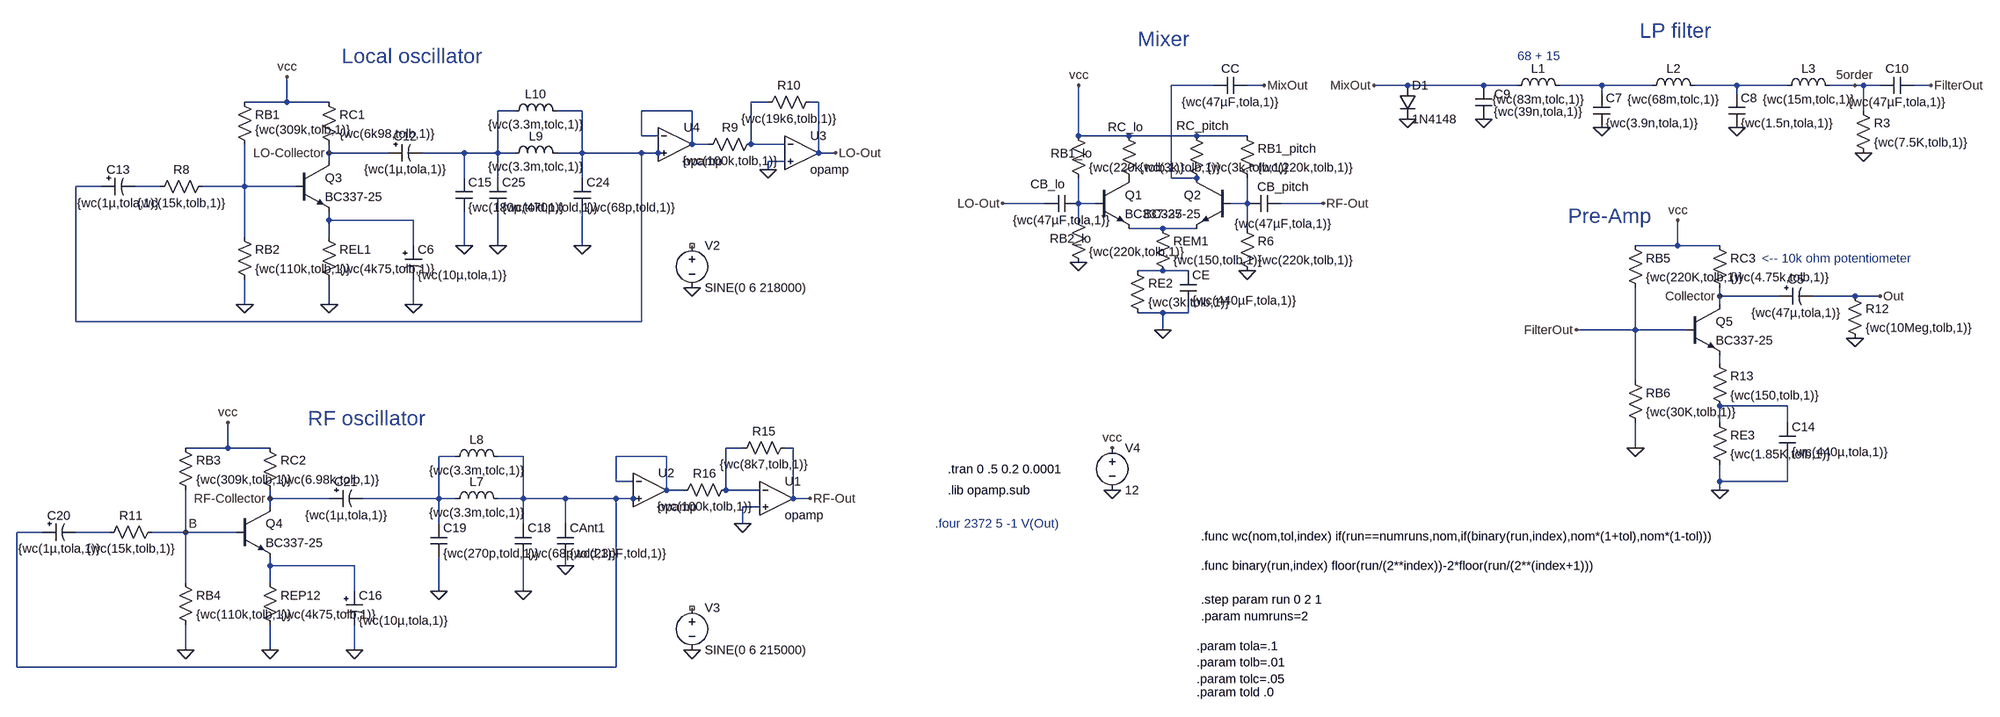
[diagram p0: schematic integrationHellWorstCaseBestCaseTolerances.asc]
integrationHellWorstCaseBestCaseTolerances.asc, the LTspice schematic file:
Version 4
SHEET 1 2740 1140
WIRE 224 -80 144 -80
WIRE 320 -80 288 -80
WIRE 592 -80 528 -80
WIRE 736 -80 592 -80
WIRE 800 -80 736 -80
WIRE 960 -80 880 -80
WIRE 1056 -80 960 -80
WIRE 1216 -80 1136 -80
WIRE 1312 -80 1216 -80
WIRE 1440 -80 1392 -80
WIRE 1456 -80 1440 -80
WIRE 1488 -80 1456 -80
WIRE 1584 -80 1552 -80
WIRE 960 -64 960 -80
WIRE 1216 -64 1216 -80
WIRE -1536 -48 -1536 -96
WIRE -1536 -48 -1616 -48
WIRE -1456 -48 -1536 -48
WIRE -624 -48 -656 -48
WIRE -528 -48 -544 -48
WIRE -1104 -32 -1136 -32
WIRE -976 -32 -1024 -32
WIRE -768 -32 -864 -32
WIRE 1456 -32 1456 -80
WIRE -864 16 -864 -32
WIRE -832 16 -864 16
WIRE -32 16 -32 -80
WIRE 64 16 -32 16
WIRE 192 16 64 16
WIRE 288 16 192 16
WIRE -768 32 -768 -32
WIRE -736 32 -768 32
WIRE -656 32 -656 -48
WIRE -592 32 -656 32
WIRE -1456 48 -1456 32
WIRE -1344 48 -1456 48
WIRE -1200 48 -1280 48
WIRE -1136 48 -1136 -32
WIRE -1136 48 -1200 48
WIRE -1104 48 -1136 48
WIRE -976 48 -976 -32
WIRE -976 48 -1024 48
WIRE -864 48 -976 48
WIRE -832 48 -832 32
WIRE -832 48 -864 48
WIRE -528 48 -528 -48
WIRE -496 48 -528 48
WIRE -1456 64 -1456 48
WIRE -592 64 -624 64
WIRE -624 80 -624 64
WIRE -1200 96 -1200 48
WIRE -1136 96 -1136 48
WIRE -976 96 -976 48
WIRE 144 96 144 -80
WIRE 192 96 144 96
WIRE -1888 112 -1936 112
WIRE -1776 112 -1824 112
WIRE -1616 112 -1616 32
WIRE -1616 112 -1696 112
WIRE -1520 112 -1616 112
WIRE -96 144 -176 144
WIRE -32 144 -32 96
WIRE 0 144 -32 144
WIRE 288 144 288 96
WIRE 288 144 256 144
WIRE 432 144 352 144
WIRE -1456 176 -1456 160
WIRE -1296 176 -1456 176
WIRE -32 176 -32 144
WIRE 128 192 64 192
WIRE 192 192 128 192
WIRE 288 192 288 144
WIRE -1616 208 -1616 112
WIRE -1456 208 -1456 176
WIRE -1296 224 -1296 176
WIRE -1200 224 -1200 160
WIRE -1136 224 -1136 160
WIRE -976 224 -976 160
WIRE 1104 224 1104 176
WIRE 1104 224 1024 224
WIRE 1184 224 1104 224
WIRE 128 272 80 272
WIRE 176 272 128 272
WIRE 1184 320 1184 304
WIRE 1296 320 1184 320
WIRE 1440 320 1360 320
WIRE 1488 320 1440 320
WIRE -1616 336 -1616 288
WIRE -1456 336 -1456 288
WIRE -1296 336 -1296 288
WIRE 1184 336 1184 320
WIRE 128 352 80 352
WIRE 176 352 176 336
WIRE 176 352 128 352
WIRE -1936 368 -1936 112
WIRE -864 368 -864 48
WIRE -864 368 -1936 368
WIRE 128 384 128 352
WIRE 1024 384 1024 304
WIRE 1024 384 912 384
WIRE 1120 384 1024 384
WIRE 1184 448 1184 432
WIRE 1024 480 1024 384
WIRE 1312 528 1184 528
WIRE 1184 560 1184 528
WIRE 1312 560 1312 528
WIRE -1648 608 -1648 560
WIRE -1648 608 -1728 608
WIRE -1568 608 -1648 608
WIRE -672 608 -704 608
WIRE -576 608 -592 608
WIRE 1024 608 1024 560
WIRE -1216 624 -1248 624
WIRE -1088 624 -1136 624
WIRE -816 624 -912 624
WIRE -912 672 -912 624
WIRE -880 672 -912 672
WIRE 1184 672 1184 640
WIRE 1312 672 1312 624
WIRE 1312 672 1184 672
WIRE -816 688 -816 624
WIRE -784 688 -816 688
WIRE -704 688 -704 608
WIRE -640 688 -704 688
WIRE 1184 688 1184 672
WIRE -1568 704 -1568 688
WIRE -1456 704 -1568 704
WIRE -1248 704 -1248 624
WIRE -1248 704 -1392 704
WIRE -1216 704 -1248 704
WIRE -1088 704 -1088 624
WIRE -1088 704 -1136 704
WIRE -1008 704 -1088 704
WIRE -912 704 -1008 704
WIRE -880 704 -880 688
WIRE -880 704 -912 704
WIRE -576 704 -576 608
WIRE -544 704 -576 704
WIRE -1568 720 -1568 704
WIRE -640 720 -672 720
WIRE -1248 752 -1248 704
WIRE -1088 752 -1088 704
WIRE -1008 752 -1008 704
WIRE -672 752 -672 720
WIRE -2000 768 -2048 768
WIRE -1872 768 -1936 768
WIRE -1728 768 -1728 688
WIRE -1728 768 -1792 768
WIRE -1632 768 -1728 768
WIRE -1568 832 -1568 816
WIRE -1408 832 -1568 832
WIRE -1008 832 -1008 816
WIRE -1728 864 -1728 768
WIRE -1568 864 -1568 832
WIRE -1408 880 -1408 832
WIRE -1248 880 -1248 816
WIRE -1088 880 -1088 816
WIRE -1728 992 -1728 944
WIRE -1568 992 -1568 944
WIRE -1408 992 -1408 944
WIRE -2048 1024 -2048 768
WIRE -912 1024 -912 704
WIRE -912 1024 -2048 1024
FLAG 128 384 0
FLAG -32 256 0
FLAG 288 272 0
FLAG -768 304 0
FLAG -768 992 0
FLAG 320 -80 MixOut
FLAG 1584 -80 FilterOut
FLAG 528 -80 MixOut
FLAG 1216 0 0
FLAG 960 0 0
FLAG 1456 48 0
FLAG 1440 -80 5order
FLAG 592 -16 0
FLAG 736 -16 0
FLAG -1536 -96 vcc
FLAG 32 608 vcc
FLAG 32 688 0
FLAG -1296 336 0
FLAG -1456 336 0
FLAG -1616 336 0
FLAG -1456 48 LO-Collector
FLAG -496 48 LO-Out
FLAG -32 -80 vcc
FLAG -176 144 LO-Out
FLAG -1648 560 vcc
FLAG -1408 992 0
FLAG -1568 992 0
FLAG -1728 992 0
FLAG -1568 704 RF-Collector
FLAG -1728 768 B
FLAG -1088 880 0
FLAG -1248 880 0
FLAG -976 224 0
FLAG -1136 224 0
FLAG 432 144 RF-Out
FLAG -544 704 RF-Out
FLAG -1008 832 0
FLAG -672 752 0
FLAG -624 80 0
FLAG 1104 176 vcc
FLAG 1184 688 0
FLAG 1024 608 0
FLAG 1184 320 Collector
FLAG 1488 320 Out
FLAG 1440 400 0
FLAG 912 384 FilterOut
FLAG -1200 224 0
DATAFLAG -1456 48 ""
SYMBOL npn 0 96 R0
SYMATTR InstName Q1
SYMATTR Value BC337-25
SYMBOL npn 256 96 M0
SYMATTR InstName Q2
SYMATTR Value BC337-25
SYMBOL res 112 176 R0
SYMATTR InstName REM1
SYMATTR Value {wc(150,tolb,1)}
SYMBOL res 64 256 R0
SYMATTR InstName RE2
SYMATTR Value {wc(3k,tolb,1)}
SYMBOL cap 160 272 R0
SYMATTR InstName CE
SYMATTR Value {wc(440µF,tola,1)}
SYMBOL res -48 0 R0
WINDOW 0 -37 49 Left 2
SYMATTR InstName RB1_lo
SYMATTR Value {wc(220k,tolb,1)}
SYMBOL res -48 160 R0
WINDOW 0 -38 51 Left 2
SYMATTR InstName RB2_lo
SYMATTR Value {wc(220k,tolb,1)}
SYMBOL res 272 176 R0
SYMATTR InstName R6
SYMATTR Value {wc(220k,tolb,1)}
SYMBOL res 272 0 R0
SYMATTR InstName RB1_pitch
SYMATTR Value {wc(220k,tolb,1)}
SYMBOL cap -32 128 R90
WINDOW 0 -5 58 VBottom 2
WINDOW 3 32 32 VTop 2
SYMATTR InstName CB_lo
SYMATTR Value {wc(47µF,tola,1)}
SYMBOL cap 352 128 R90
WINDOW 0 0 -4 VBottom 2
WINDOW 3 39 -4 VTop 2
SYMATTR InstName CB_pitch
SYMATTR Value {wc(47µF,tola,1)}
SYMBOL voltage -768 208 R0
WINDOW 123 0 0 Left 0
WINDOW 39 0 0 Left 0
SYMATTR InstName V2
SYMATTR Value SINE(0 6 218000)
SYMBOL voltage -768 896 R0
WINDOW 123 0 0 Left 0
WINDOW 39 0 0 Left 0
SYMATTR InstName V3
SYMATTR Value SINE(0 6 215000)
SYMBOL cap 288 -96 R90
WINDOW 0 0 32 VBottom 2
WINDOW 3 32 32 VTop 2
SYMATTR InstName CC
SYMATTR Value {wc(47µF,tola,1)}
SYMBOL res 176 0 R0
WINDOW 0 -22 -3 Left 2
SYMATTR InstName RC_pitch
SYMATTR Value {wc(3k,tolb,1)}
SYMBOL ind 784 -64 R270
WINDOW 0 32 56 VTop 2
WINDOW 3 5 56 VBottom 2
SYMATTR InstName L1
SYMATTR Value {wc(83m,tolc,1)}
SYMBOL ind 1040 -64 R270
WINDOW 0 32 56 VTop 2
WINDOW 3 5 56 VBottom 2
SYMATTR InstName L2
SYMATTR Value {wc(68m,tolc,1)}
SYMBOL cap 944 -64 R0
SYMATTR InstName C7
SYMATTR Value {wc(3.9n,tola,1)}
SYMBOL cap 1200 -64 R0
SYMATTR InstName C8
SYMATTR Value {wc(1.5n,tola,1)}
SYMBOL ind 1296 -64 R270
WINDOW 0 32 56 VTop 2
WINDOW 3 5 56 VBottom 2
SYMATTR InstName L3
SYMATTR Value {wc(15m,tolc,1)}
SYMBOL res 1440 -48 R0
SYMATTR InstName R3
SYMATTR Value {wc(7.5K,tolb,1)}
SYMBOL diode 576 -80 R0
SYMATTR InstName D1
SYMATTR Value 1N4148
SYMBOL cap 720 -80 R0
WINDOW 0 36 17 Left 2
WINDOW 3 35 50 Left 2
SYMATTR InstName C9
SYMATTR Value {wc(39n,tola,1)}
SYMBOL cap 1552 -96 R90
WINDOW 0 0 32 VBottom 2
WINDOW 3 32 32 VTop 2
SYMATTR InstName C10
SYMATTR Value {wc(47µF,tola,1)}
SYMBOL res -1632 -64 R0
WINDOW 3 36 68 Left 2
SYMATTR Value {wc(309k,tolb,1)}
SYMATTR InstName RB1
SYMBOL res -1472 -64 R0
SYMATTR InstName RC1
SYMATTR Value {wc(6k98,tolb,1)}
SYMBOL res -1472 192 R0
SYMATTR InstName REL1
SYMATTR Value {wc(4k75,tolb,1)}
SYMBOL res -1632 192 R0
SYMATTR InstName RB2
SYMATTR Value {wc(110k,tolb,1)}
SYMBOL polcap -1312 224 R0
SYMATTR InstName C6
SYMATTR Value {wc(10µ,tola,1)}
SYMBOL voltage 32 592 R0
WINDOW 123 0 0 Left 0
WINDOW 39 0 0 Left 0
SYMATTR InstName V4
SYMATTR Value 12
SYMBOL npn -1520 64 R0
SYMATTR InstName Q3
SYMATTR Value BC337-25
SYMBOL res -1680 96 R90
WINDOW 0 0 56 VBottom 2
WINDOW 3 32 56 VTop 2
SYMATTR InstName R8
SYMATTR Value {wc(15k,tolb,1)}
SYMBOL polcap -1344 32 M90
WINDOW 0 0 32 VBottom 2
WINDOW 3 32 32 VTop 2
SYMATTR InstName C12
SYMATTR Value {wc(1µ,tola,1)}
SYMBOL polcap -1888 96 M90
WINDOW 0 0 32 VBottom 2
WINDOW 3 32 32 VTop 2
SYMATTR InstName C13
SYMATTR Value {wc(1µ,tola,1)}
SYMBOL res -1744 592 R0
SYMATTR InstName RB3
SYMATTR Value {wc(309k,tolb,1)}
SYMBOL res -1584 592 R0
SYMATTR InstName RC2
SYMATTR Value {wc(6.98k,tolb,1)}
SYMBOL res -1584 848 R0
SYMATTR InstName REP12
SYMATTR Value {wc(4k75,tolb,1)}
SYMBOL res -1744 848 R0
SYMATTR InstName RB4
SYMATTR Value {wc(110k,tolb,1)}
SYMBOL polcap -1424 880 R0
SYMATTR InstName C16
SYMATTR Value {wc(10µ,tola,1)}
SYMBOL npn -1632 720 R0
SYMATTR InstName Q4
SYMATTR Value BC337-25
SYMBOL res -1776 752 R90
WINDOW 0 0 56 VBottom 2
WINDOW 3 32 56 VTop 2
SYMATTR InstName R11
SYMATTR Value {wc(15k,tolb,1)}
SYMBOL ind -1120 720 M270
WINDOW 0 32 56 VTop 2
WINDOW 3 5 56 VBottom 2
SYMATTR InstName L7
SYMATTR Value {wc(3.3m,tolc,1)}
SYMBOL cap -1104 752 R0
SYMATTR InstName C18
SYMATTR Value {wc(68p,told,1)}
SYMBOL cap -1264 752 R0
SYMATTR InstName C19
SYMATTR Value {wc(270p,told,1)}
SYMBOL cap -1024 752 R0
SYMATTR InstName CAnt1
SYMATTR Value {wc(23pF,told,1)}
SYMBOL polcap -2000 752 M90
WINDOW 0 0 32 VBottom 2
WINDOW 3 32 32 VTop 2
SYMATTR InstName C20
SYMATTR Value {wc(1µ,tola,1)}
SYMBOL polcap -1456 688 M90
WINDOW 0 0 32 VBottom 2
WINDOW 3 32 32 VTop 2
SYMATTR InstName C21
SYMATTR Value {wc(1µ,tola,1)}
SYMBOL ind -1232 640 R270
WINDOW 0 32 56 VTop 2
WINDOW 3 5 56 VBottom 2
SYMATTR InstName L8
SYMATTR Value {wc(3.3m,tolc,1)}
SYMBOL ind -1008 64 M270
WINDOW 0 32 56 VTop 2
WINDOW 3 5 56 VBottom 2
SYMATTR InstName L9
SYMATTR Value {wc(3.3m,tolc,1)}
SYMBOL cap -992 96 R0
SYMATTR InstName C24
SYMATTR Value {wc(68p,told,1)}
SYMBOL cap -1152 96 R0
SYMATTR InstName C25
SYMATTR Value {wc(470p,told,1)}
SYMBOL ind -1120 -16 R270
WINDOW 0 32 56 VTop 2
WINDOW 3 5 56 VBottom 2
SYMATTR InstName L10
SYMATTR Value {wc(3.3m,tolc,1)}
SYMBOL res 48 0 R0
WINDOW 0 -24 -1 Left 2
SYMATTR InstName RC_lo
SYMATTR Value {wc(3k,tolb,1)}
SYMBOL OpAmps\\opamp -560 -16 R0
SYMATTR InstName U3
SYMBOL OpAmps\\opamp -800 -32 R0
SYMATTR InstName U4
SYMBOL res -528 -64 R90
WINDOW 0 0 56 VBottom 2
WINDOW 3 32 56 VTop 2
SYMATTR InstName R10
SYMATTR Value {wc(19k6,tolb,1)}
SYMBOL res -640 16 R90
WINDOW 0 0 56 VBottom 2
WINDOW 3 32 56 VTop 2
SYMATTR InstName R9
SYMATTR Value {wc(100k,tolb,1)}
SYMBOL OpAmps\\opamp -608 640 R0
SYMATTR InstName U1
SYMBOL OpAmps\\opamp -848 624 R0
SYMATTR InstName U2
SYMBOL res -576 592 R90
WINDOW 0 0 56 VBottom 2
WINDOW 3 32 56 VTop 2
SYMATTR InstName R15
SYMATTR Value {wc(8k7,tolb,1)}
SYMBOL res -688 672 R90
WINDOW 0 0 56 VBottom 2
WINDOW 3 32 56 VTop 2
SYMATTR InstName R16
SYMATTR Value {wc(100k,tolb,1)}
SYMBOL res 1008 208 R0
SYMATTR InstName RB5
SYMATTR Value {wc(220K,tolb,1)}
SYMBOL res 1168 208 R0
SYMATTR InstName RC3
SYMATTR Value {wc(4.75k,tolb,1)}
SYMBOL res 1168 544 R0
SYMATTR InstName RE3
SYMATTR Value {wc(1.85K,tolb,1)}
SYMBOL res 1008 464 R0
SYMATTR InstName RB6
SYMATTR Value {wc(30K,tolb,1)}
SYMBOL polcap 1296 304 M90
WINDOW 0 0 32 VBottom 2
WINDOW 3 32 32 VTop 2
SYMATTR InstName C5
SYMATTR Value {wc(47µ,tola,1)}
SYMBOL res 1424 304 R0
SYMATTR InstName R12
SYMATTR Value {wc(10Meg,tolb,1)}
SYMBOL npn 1120 336 R0
SYMATTR InstName Q5
SYMATTR Value BC337-25
SYMBOL cap 1296 560 R0
SYMATTR InstName C14
SYMATTR Value {wc(440µ,tola,1)}
SYMBOL res 1168 432 R0
SYMATTR InstName R13
SYMATTR Value {wc(150,tolb,1)}
SYMBOL cap -1216 96 R0
SYMATTR InstName C15
SYMATTR Value {wc(180p,told,1)}
TEXT -280 648 Left 2 !.tran 0 .5 0.2 0.0001
TEXT -280 688 Left 2 !.lib opamp.sub
TEXT -1432 -136 Left 4 ;Local oscillator
TEXT -1496 552 Left 4 ;RF oscillator
TEXT 80 -168 Left 4 ;Mixer
TEXT 1032 -184 Left 4 ;LP filter
TEXT 896 168 Left 4 ;Pre-Amp
TEXT 1264 248 Left 2 ;<-- 10k ohm potentiometer
TEXT 800 -136 Left 2 ;68 + 15
TEXT -304 752 Left 2 ;.four 2372 5 -1 V(Out)
TEXT 200 776 Left 2 !.func wc(nom,tol,index) if(run==numruns,nom,if(binary(run,index),nom*(1+tol),nom*(1-tol)))
TEXT 200 832 Left 2 !.func binary(run,index) floor(run/(2**index))-2*floor(run/(2**(index+1)))
TEXT 192 984 Left 2 !.param tola=.1\n.param tolb=.01\n.param tolc=.05
TEXT 200 896 Left 2 !.step param run 0 2 1\n.param numruns=2
TEXT 192 1072 Left 2 !.param told .0

The netlist it stands for:
* integrationHellWorstCaseBestCaseTolerances.asc
Q1 P001 N010 N013 0 BC337-25
Q2 N001 N011 N013 0 BC337-25
REM1 N013 N014 {wc(150,tolb,1)}
RE2 N014 0 {wc(3k,tolb,1)}
CE N014 0 {wc(440µF,tola,1)}
RB1_lo vcc N010 {wc(220k,tolb,1)}
RB2_lo N010 0 {wc(220k,tolb,1)}
R6 N011 0 {wc(220k,tolb,1)}
RB1_pitch vcc N011 {wc(220k,tolb,1)}
CB_lo N010 LO-Out {wc(47µF,tola,1)}
CB_pitch RF-Out N011 {wc(47µF,tola,1)}
V2 NC_01 0 SINE(0 6 218000)
V3 NC_02 0 SINE(0 6 215000)
CC MixOut N001 {wc(47µF,tola,1)}
RC_pitch vcc N001 {wc(3k,tolb,1)}
L1 MixOut N002 {wc(83m,tolc,1)}
L2 N002 N003 {wc(68m,tolc,1)}
C7 N002 0 {wc(3.9n,tola,1)}
C8 N003 0 {wc(1.5n,tola,1)}
L3 N003 5order {wc(15m,tolc,1)}
R3 5order 0 {wc(7.5K,tolb,1)}
D1 MixOut 0 1N4148
C9 MixOut 0 {wc(39n,tola,1)}
C10 FilterOut 5order {wc(47µF,tola,1)}
RB1 vcc N009 {wc(309k,tolb,1)}
RC1 vcc LO-Collector {wc(6k98,tolb,1)}
REL1 N012 0 {wc(4k75,tolb,1)}
RB2 N009 0 {wc(110k,tolb,1)}
C6 N012 0 {wc(10µ,tola,1)}
V4 vcc 0 12
Q3 LO-Collector N009 N012 0 BC337-25
R8 N009 N008 {wc(15k,tolb,1)}
C12 LO-Collector N005 {wc(1µ,tola,1)}
C13 N006 N008 {wc(1µ,tola,1)}
RB3 vcc B {wc(309k,tolb,1)}
RC2 vcc RF-Collector {wc(6.98k,tolb,1)}
REP12 N022 0 {wc(4k75,tolb,1)}
RB4 B 0 {wc(110k,tolb,1)}
C16 N022 0 {wc(10µ,tola,1)}
Q4 RF-Collector B N022 0 BC337-25
R11 B N021 {wc(15k,tolb,1)}
L7 N019 N018 {wc(3.3m,tolc,1)}
C18 N019 0 {wc(68p,told,1)}
C19 N018 0 {wc(270p,told,1)}
CAnt1 N019 0 {wc(23pF,told,1)}
C20 N019 N021 {wc(1µ,tola,1)}
C21 RF-Collector N018 {wc(1µ,tola,1)}
L8 N018 N019 {wc(3.3m,tolc,1)}
L9 N006 N005 {wc(3.3m,tolc,1)}
C24 N006 0 {wc(68p,told,1)}
C25 N005 0 {wc(470p,told,1)}
L10 N005 N006 {wc(3.3m,tolc,1)}
RC_lo vcc P001 {wc(3k,tolb,1)}
XU3 N004 0 LO-Out opamp Aol=100K GBW=10Meg  ; pins invin noninvin out
XU4 N007 N006 N007 opamp Aol=100K GBW=10Meg  ; pins invin noninvin out
R10 LO-Out N004 {wc(19k6,tolb,1)}
R9 N004 N007 {wc(100k,tolb,1)}
XU1 N017 0 RF-Out opamp Aol=100K GBW=10Meg  ; pins invin noninvin out
XU2 N020 N019 N020 opamp Aol=100K GBW=10Meg  ; pins invin noninvin out
R15 RF-Out N017 {wc(8k7,tolb,1)}
R16 N017 N020 {wc(100k,tolb,1)}
RB5 vcc FilterOut {wc(220K,tolb,1)}
RC3 vcc Collector {wc(4.75k,tolb,1)}
RE3 N016 0 {wc(1.85K,tolb,1)}
RB6 FilterOut 0 {wc(30K,tolb,1)}
C5 Collector Out {wc(47µ,tola,1)}
R12 Out 0 {wc(10Meg,tolb,1)}
Q5 Collector FilterOut N015 0 BC337-25
C14 N016 0 {wc(440µ,tola,1)}
R13 N015 N016 {wc(150,tolb,1)}
C15 N005 0 {wc(180p,told,1)}
.model D D
.lib standard.dio
.model NPN NPN
.model PNP PNP
.lib standard.bjt
.tran 0 .5 0.2 0.0001
.lib opamp.sub
* Local oscillator
* RF oscillator
* Mixer
* LP filter
* Pre-Amp
* <-- 10k ohm potentiometer
* 68 + 15
* .four 2372 5 -1 V(Out)
.func wc(nom,tol,index) if(run==numruns,nom,if(binary(run,index),nom*(1+tol),nom*(1-tol)))
.func binary(run,index) floor(run/(2**index))-2*floor(run/(2**(index+1)))
.param tola=.1
.param tolb=.01
.param tolc=.05
.step param run 0 2 1
.param numruns=2
.param told .0
.backanno
.end